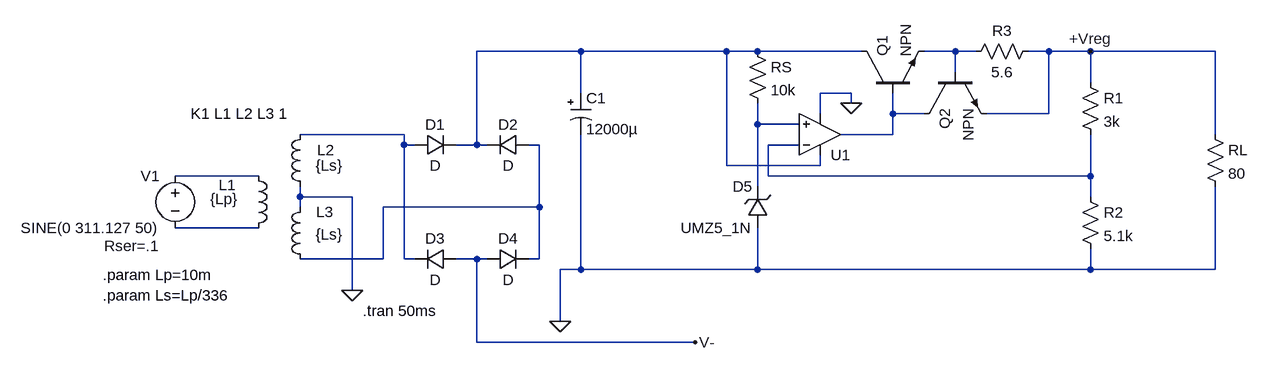
[diagram p0: schematic Power Supply - No IC - Headphones.asc]
Power Supply - No IC - Headphones.asc, the LTspice schematic file:
Version 4.1
SHEET 1 2676 776
WIRE 496 -80 336 -80
WIRE 720 -80 496 -80
WIRE 768 -80 720 -80
WIRE 928 -80 768 -80
WIRE 1072 -80 1024 -80
WIRE 1104 -80 1072 -80
WIRE 1216 -80 1184 -80
WIRE 1280 -80 1216 -80
WIRE 1472 -80 1280 -80
WIRE 1072 -48 1072 -80
WIRE 1280 -32 1280 -80
WIRE 496 -16 496 -80
WIRE 912 -16 864 -16
WIRE 912 0 912 -16
WIRE 864 16 864 -16
WIRE 976 16 976 -16
WIRE 1024 16 976 16
WIRE 1216 16 1216 -80
WIRE 1216 16 1120 16
WIRE 768 32 768 0
WIRE 832 32 768 32
WIRE 224 48 64 48
WIRE 976 48 976 16
WIRE 976 48 896 48
WIRE 1472 48 1472 -80
WIRE 224 64 224 48
WIRE 240 64 224 64
WIRE 336 64 336 -80
WIRE 336 64 304 64
WIRE 352 64 336 64
WIRE 432 64 416 64
WIRE 832 64 784 64
WIRE 720 96 720 -80
WIRE 864 96 864 80
WIRE 864 96 720 96
WIRE 0 112 -128 112
WIRE 784 112 784 64
WIRE 1280 112 1280 48
WIRE 1280 112 784 112
WIRE 768 128 768 32
WIRE 64 144 64 128
WIRE 144 144 64 144
WIRE 1280 144 1280 112
WIRE 64 160 64 144
WIRE 432 160 432 64
WIRE 432 160 192 160
WIRE 0 192 -128 192
WIRE 192 240 192 160
WIRE 192 240 64 240
WIRE 224 240 224 64
WIRE 240 240 224 240
WIRE 336 240 304 240
WIRE 352 240 336 240
WIRE 432 240 432 160
WIRE 432 240 416 240
WIRE 496 256 496 48
WIRE 496 256 464 256
WIRE 768 256 768 192
WIRE 768 256 496 256
WIRE 1280 256 1280 224
WIRE 1280 256 768 256
WIRE 1472 256 1472 128
WIRE 1472 256 1280 256
WIRE 144 288 144 144
WIRE 464 336 464 256
WIRE 336 368 336 240
WIRE 672 368 336 368
FLAG 464 336 0
FLAG 144 288 0
FLAG 912 0 0
FLAG 1280 -80 +Vreg
FLAG 672 368 V-
SYMBOL diode 240 80 R270
WINDOW 0 32 32 VTop 2
WINDOW 3 0 32 VBottom 2
SYMATTR InstName D1
SYMBOL diode 416 80 M270
WINDOW 0 32 32 VTop 2
WINDOW 3 0 32 VBottom 2
SYMATTR InstName D2
SYMBOL diode 304 256 M270
WINDOW 0 32 32 VTop 2
WINDOW 3 0 32 VBottom 2
SYMATTR InstName D3
SYMBOL diode 352 256 R270
WINDOW 0 32 32 VTop 2
WINDOW 3 0 32 VBottom 2
SYMATTR InstName D4
SYMBOL polcap 480 -16 R0
SYMATTR InstName C1
SYMATTR Value 12000µ
SYMBOL voltage -128 96 M0
WINDOW 123 0 0 Left 0
WINDOW 39 24 124 Left 2
SYMATTR SpiceLine Rser=.1
SYMATTR InstName V1
SYMATTR Value SINE(0 311.127 50)
SYMBOL ind -16 208 M180
WINDOW 0 -45 82 Left 2
WINDOW 3 -58 61 Left 2
SYMATTR InstName L1
SYMATTR Value {Lp}
SYMATTR SpiceLine Rser=1m
SYMBOL ind 80 144 R180
WINDOW 0 -37 72 Left 2
WINDOW 3 -50 48 Left 2
SYMATTR InstName L2
SYMATTR Value {Ls}
SYMATTR SpiceLine Rser=1m
SYMBOL ind 80 256 R180
WINDOW 0 -36 89 Left 2
WINDOW 3 -50 54 Left 2
SYMATTR InstName L3
SYMATTR Value {Ls}
SYMATTR SpiceLine Rser=1m
SYMBOL npn 928 -16 R270
SYMATTR InstName Q1
SYMBOL npn 1024 -48 M90
SYMATTR InstName Q2
SYMBOL res 1200 -96 R90
WINDOW 0 0 56 VBottom 2
WINDOW 3 32 56 VTop 2
SYMATTR InstName R3
SYMATTR Value 5.6
SYMBOL res 1264 -48 R0
SYMATTR InstName R1
SYMATTR Value 3k
SYMBOL res 1264 128 R0
SYMATTR InstName R2
SYMATTR Value 5.1k
SYMBOL res 752 -96 R0
SYMATTR InstName RS
SYMATTR Value 10k
SYMBOL sym\\ZZZ\\OpAmps\\UniversalOpamp 864 48 M180
SYMATTR InstName U1
SYMBOL zener 784 192 R180
WINDOW 0 24 64 Left 2
WINDOW 3 24 0 Left 2
SYMATTR InstName D5
SYMATTR Value UMZ5_1N
SYMBOL res 1456 32 R0
SYMATTR InstName RL
SYMATTR Value 80
TEXT 160 320 Left 2 !.tran 50ms
TEXT -104 16 Left 2 !K1 L1 L2 L3 1
TEXT -240 264 Left 2 !.param Lp=10m
TEXT -240 296 Left 2 !.param Ls=Lp/336

The netlist it stands for:
* Power Supply - No IC - Headphones.asc
D1 N005 N001 D
D2 N006 N001 D
D3 V- N005 D
D4 V- N006 D
C1 N001 0 12000µ
V1 N008 N009 SINE(0 311.127 50) Rser=.1
L1 N009 N008 {Lp} Rser=1m
L2 0 N005 {Ls} Rser=1m
L3 N006 0 {Ls} Rser=1m
Q1 N001 N003 N002 0 NPN
Q2 N003 N002 +Vreg 0 NPN
R3 +Vreg N002 5.6
R1 +Vreg N007 3k
R2 N007 0 5.1k
RS N001 N004 10k
X§U1 N004 N007 N001 0 N003 level1 Avol=1Meg GBW=10Meg Vos=0 En=0 Enk=0 In=0 Ink=0 Rin=500Meg  ; pins In+ In- V+ V- OUT
D5 0 N004 UMZ5_1N
RL +Vreg 0 80
.model D D
.lib standard.dio
.model NPN NPN
.model PNP PNP
.lib standard.bjt
.tran 50ms
K1 L1 L2 L3 1
.param Lp=10m
.param Ls=Lp/336
.lib UniversalOpAmp1.lib
.backanno
.end